# EAGLE design 5VPart (EAGLE 9.6.2)
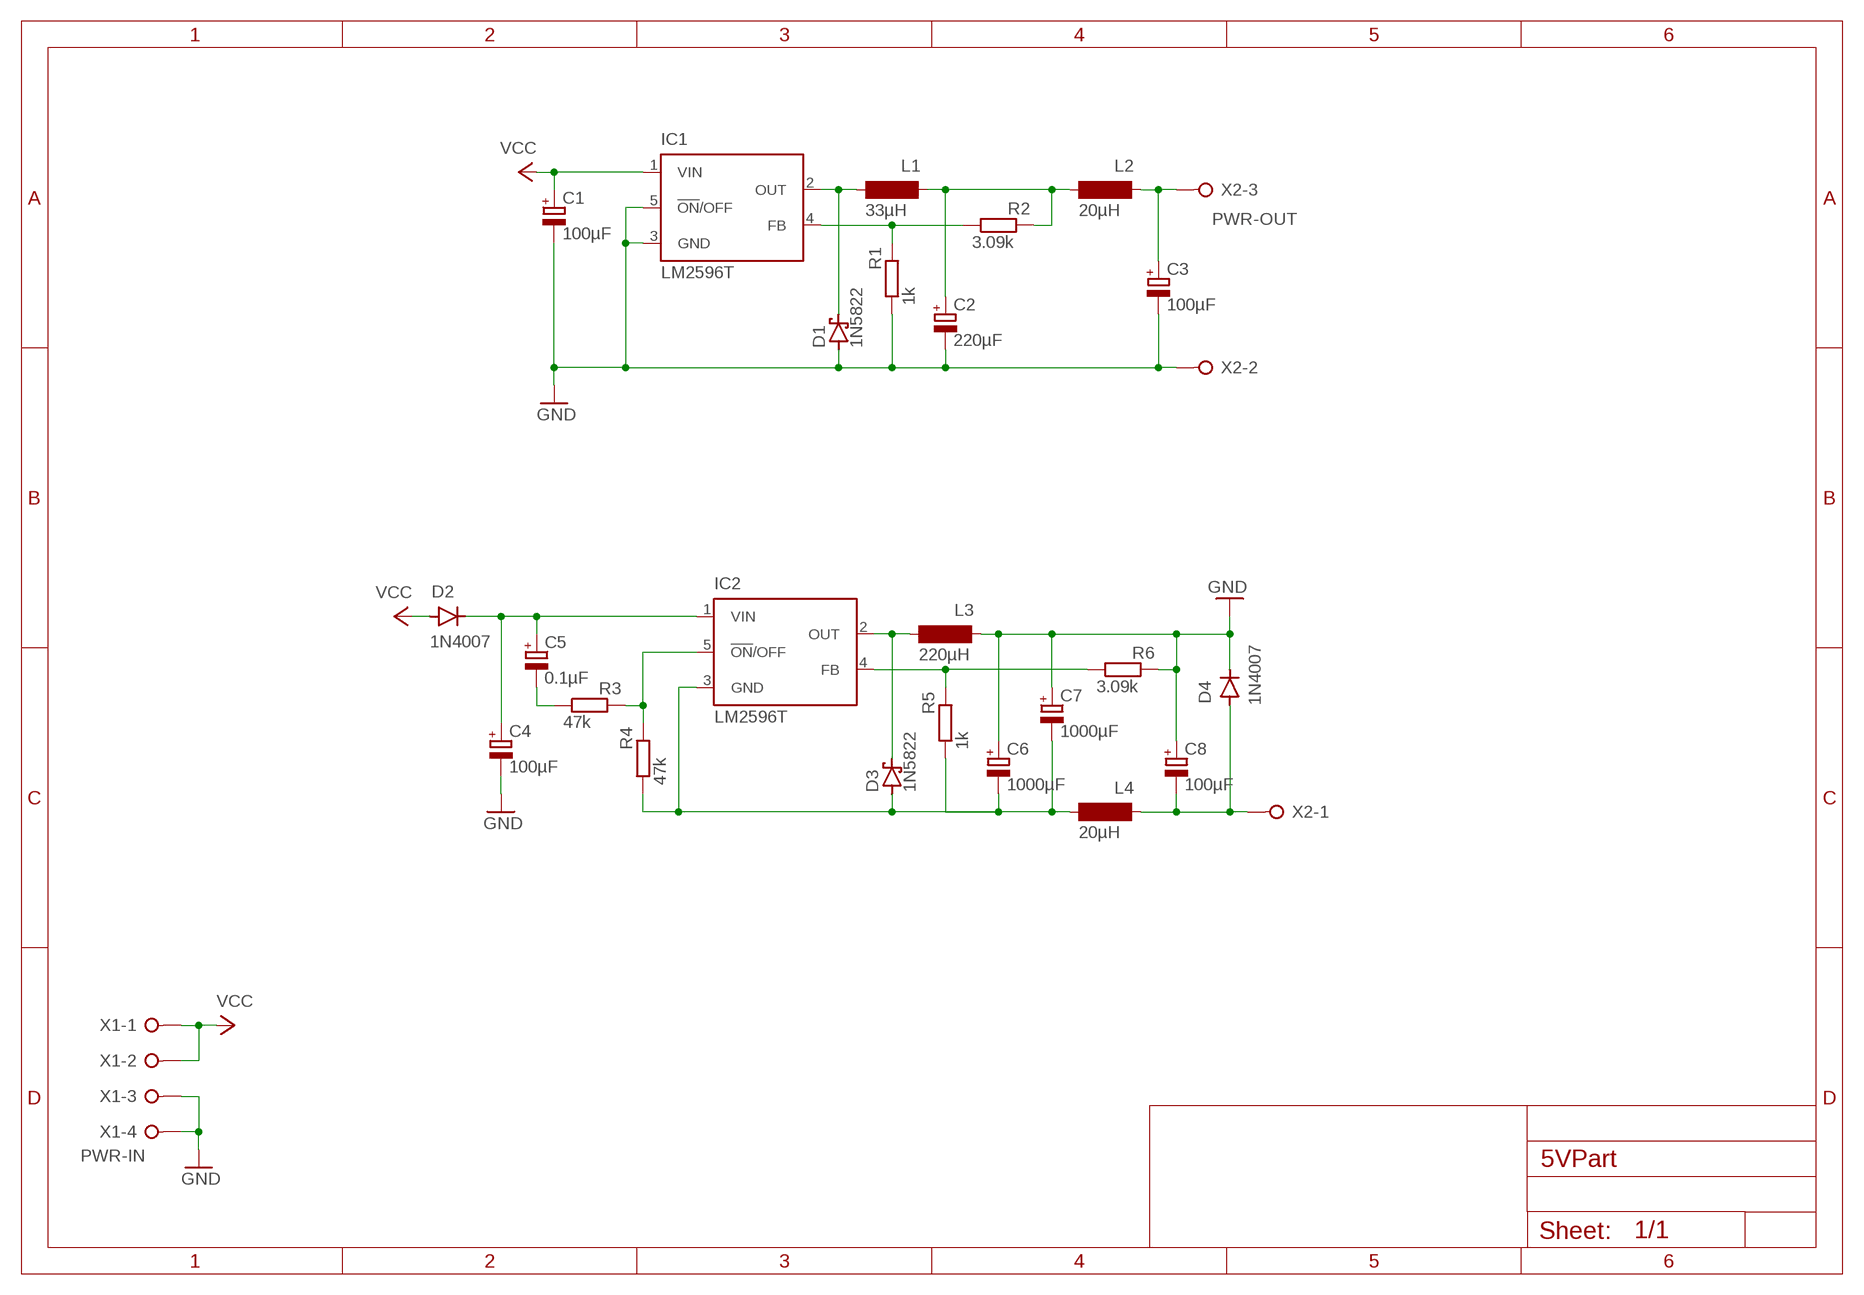
[diagram p0: schematic, sheet 1]

## Parts
C1  100µF  CPOL-EUE2.5-6  [E2,5-6]
C2  220µF  CPOL-EUE2.5-6  [E2,5-6]
C3  100µF  CPOL-EUE2.5-6  [E2,5-6]
C4  100µF  CPOL-EUE2.5-6  [E2,5-6]
C5  0.1µF  CPOL-EUE2-4  [E2-4]
C6  1000µF  CPOL-EUE5-10.5  [E5-10,5]
C7  1000µF  CPOL-EUE5-10.5  [E5-10,5]
C8  100µF  CPOL-EUE2.5-6  [E2,5-6]
D1  1N5822  1N5908  [C4111-15]
D2  1N4007  [DO-41]
D3  1N5822  1N5908  [C4111-15]
D4  1N4007  [DO-41]
IC1  LM2596T  [T05D]
IC2  LM2596T  [T05D]
L1  33µH  IND-120-330K  [IND-120]
L2  20µH  B82111B0000C020  [B82111B]
L3  220µH  11PHC-221K-50  [11PHC]
L4  20µH  B82111B0000C020  [B82111B]
R1  1k  R-EU_0207/10  [0207/10]
R2  3.09k  R-EU_0207/10  [0207/10]
R3  47k  R-EU_0207/10  [0207/10]
R4  47k  R-EU_0207/10  [0207/10]
R5  1k  R-EU_0207/10  [0207/10]
R6  3.09k  R-EU_0207/10  [0207/10]
X1  PWR-IN  W237-04P  [W237-4P]
X2  PWR-OUT  W237-03P  [W237-133]

## Nets
GND: C1.- C2.- C3.- C4.- C6.+ C7.+ C8.+ D1.A D4.C IC1.3(GND) IC1.5(!ON!/OFF) L3.P$2 R1.1 R6.2 X1.3 X1.4 X2.2
N$1: C4.+ C5.+ D2.C IC2.1(VIN)
N$3: C8.- D4.A L4.P$2 X2.1
N$4: D1.C IC1.2(OUT) L1.P$1
N$5: IC1.4(FB) R1.2 R2.1
N$6: C2.+ L1.P$2 L2.P$1 R2.2
N$7: C3.+ L2.P$2 X2.3
N$9: C5.- R3.1
N$10: IC2.5(!ON!/OFF) R3.2 R4.2
N$11: C6.- C7.- D3.A IC2.3(GND) L4.P$1 R4.1 R5.1
N$12: D3.C IC2.2(OUT) L3.P$1
N$14: IC2.4(FB) R5.2 R6.1
VCC: C1.+ D2.A IC1.1(VIN) X1.1 X1.2

## Library data of the parts
C1-C8 = rcl:CPOL-EU: POLARIZED CAPACITOR, European symbol; SPICEPREFIX: C
D1 D3 = diode:1N5908: DIODE schottky
D2 D4 = Diodes:1N4007: DIODE GEN PURP 1KV 1A DO41 Manufacturer's datasheet <https://www.mccsemi.com/pdf/Products/1N4001-1N4007(DO-41).pdf>; CREATED_BY: PCBLayout.com; DIGIKEY_PART_NUMBER: 1N4007MSCT-ND; MANUFACTURER: Micro Commercial Co; MPN: 1N4007; PACKAGE: DO-41
IC1 IC2 = national-semiconductor:LM2596: SIMPLE SWITCHER® Power Converter 150 kHz 3A Step-Down Voltage Regulator Source: http://www.national.com/ds/LM/LM2596.pdf; MPN: LM2596T-ADJ/LF02; OC_FARNELL: 9494162; OC_NEWARK: 65K5910
L1 = bb84:IND-120-330K
L2 L4 = bb84:B82111B0000C020: Axiale VHF-Drossel Epcos B82111B Ferritzylinderkern mit einer Schicht lackiertem Kupferdraht umwickelt, Wicklung als Isolierhülse aus Polyester Mit hoher Resonanzfrequenz. Für HF-Unterdrückung und HF-Filter, Störimpulsunterdrückung in kleinen Geräten, Entkopplung bei Telekomgeräten und in der Unterhaltungselektronik VDE 0565-2 (nicht B82500). Eigenschaft Wert Induktivität 20 μH Gleichstrom max. 3A Montageart Axial Gleichstromwiderstand max. 54mΩ Toleranz ±20% Durchmesser 6mm Länge 29mm Abmessungen 6 (Dia.) x 29mm Kernmaterial Ferrit Resonanzfrequenz max. 125MHz Serie B82111B Betriebstemperatur min. -55°C Anschlussdurchmesser 0.5mm Betriebstemperatur max. +125°C Anschlussklemmentyp Axialanschluss
L3 = bb84:11PHC-221K-50: Stehende-Induktivität, 11PHC, Ferrit, 220 µH Allgemeines Typ: Induktivität Bauform: 11PHC Toleranz: ±10% Anschlüsse / Schnittstellen Anschluss: radial, stehend Elektrische Werte Induktivität: 220 µH Strom: 1,68A Widerstand: 0,53 Ohm Maße Ø: 12,0mm Höhe: 15,0mm Rastermaß: 5,0 mm Herstellerangaben Hersteller: FASTRON Artikelnummer des Herstellers: 11PHC-221K-50 Verpackungsgewicht: 0.004kg RoHS: konform EAN/GTIN: 9900001386770
R1-R6 = rcl:R-EU_: RESISTOR, European symbol; SPICEPREFIX: R
X1 = con-wago-508:W237-04P: WAGO SREW CLAMP; OC_FARNELL: unknown; OC_NEWARK: unknown
X2 = con-wago-508:W237-03P: WAGO SREW CLAMP; OC_FARNELL: unknown; OC_NEWARK: unknown

## Board
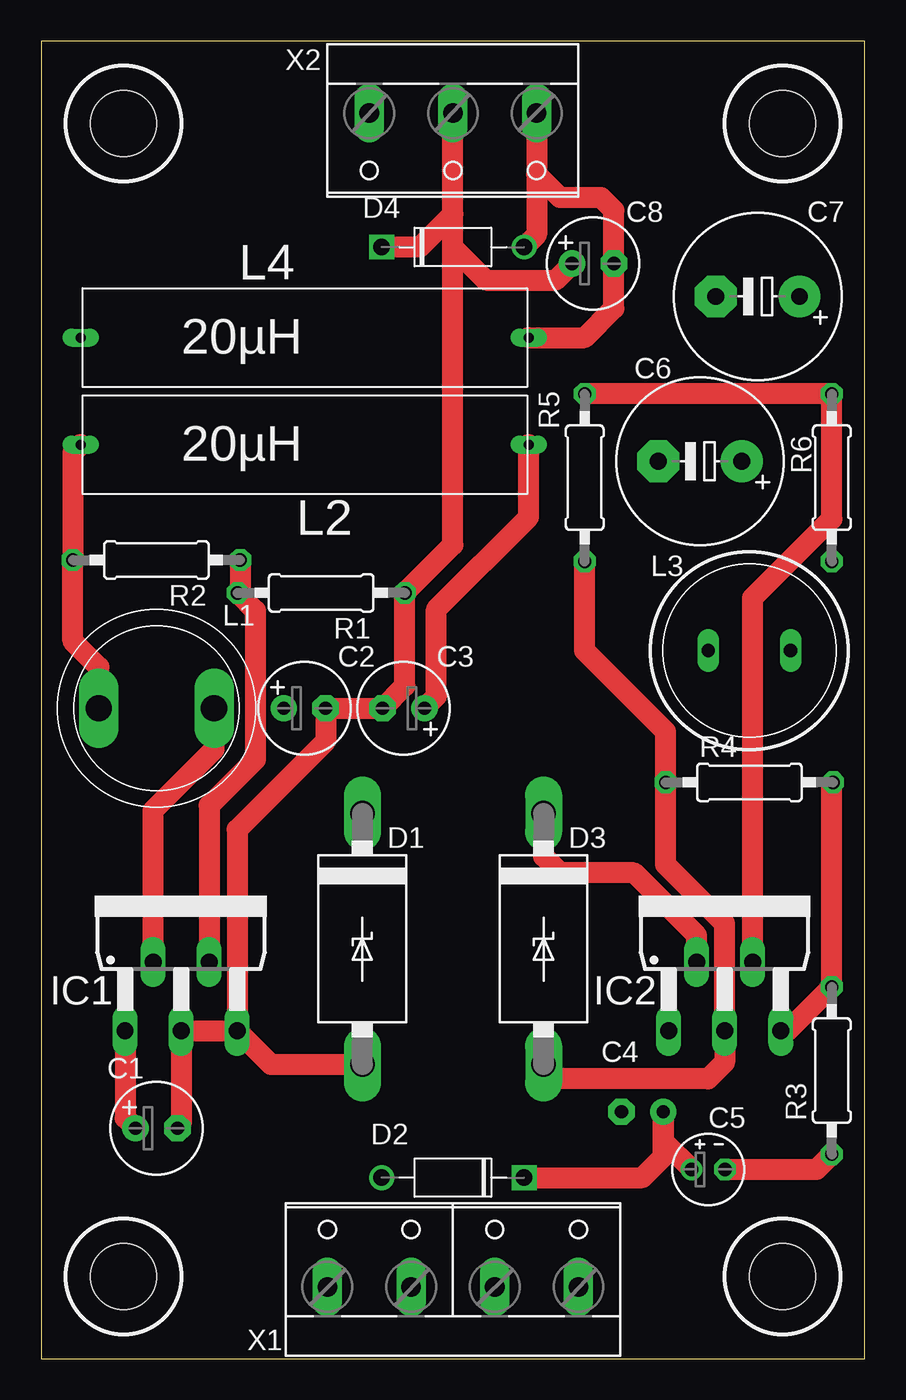
[diagram p1: board, top side]
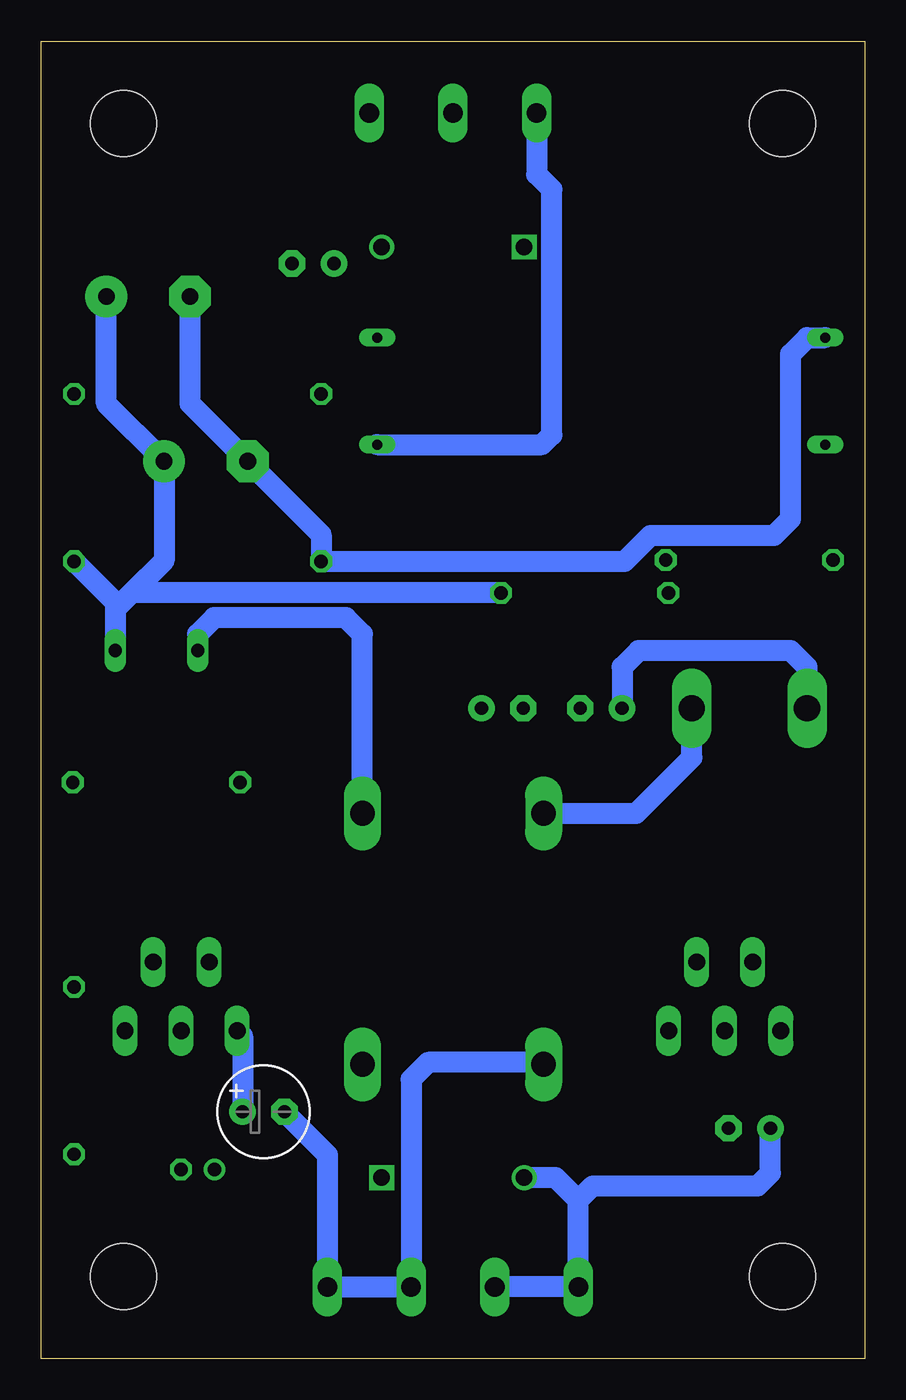
[diagram p2: board, bottom side, seen from below]

Size 50 x 80 mm. Coordinates in mm from the lower left corner, seen from the top.
Outline: 0,0 50,0 50,80 0,80 0,0
Copper layers (1*16): Top 0.035mm / dielectric 1.5mm / Bottom 0.035mm
Design rules "default *": minimum track width 50mil, minimum drill 0.5mm, track to track 6mil, track to pad 6mil, pad to pad 6mil, via to via 6mil, smd to smd 6mil, copper to edge 40mil, drill to drill 6mil, minimum pad ring 10mil, minimum via ring 8mil, stop-mask expansion 4mil, vias tented up to drill 0mil, thermal gap 10mil
Holes 4 mm at 5,5 5,75 45,5 45,75

### Footprints (pad centres in the part's own frame; a part is rotated, then mirrored left to right if it is on the bottom)
E2,5-6 = drill 0.813 pad 1.6: + -1.27,0 | drill 0.813 pad 1.6 octagon: - 1.27,0
E2-4 = drill 0.813 pad 1.27: + -1.016,0 | drill 0.813 pad 1.27 octagon: - 1.016,0
E5-10,5 = drill 1.016 pad 2.54: + -2.54,0 | drill 1.016 pad 2.54 octagon: - 2.54,0
C4111-15 = drill 1.499 long: A 7.62,0; C -7.62,0
DO-41 = drill 1: A 4.325,0 | drill 1 square: C -4.325,0
T05D = drill 1.016 long: 1 -3.404,-5.08; 2 -1.702,-0.914; 3 0,-5.08; 4 1.702,-0.914; 5 3.404,-5.08
IND-120 = drill 1.6 long: P$1 -3.5,0; P$2 3.5,0
B82111B = drill 0.6 long: P$1 -13.6,0; P$2 13.6,0
11PHC = drill 0.8 long: P$1 -2.5,0; P$2 2.5,0
0207/10 = drill 0.813 octagon: 1 -5.08,0; 2 5.08,0
W237-4P = drill 1.194 long: 1 -7.62,-0.635; 2 -2.54,-0.635; 3 2.54,-0.635; 4 7.62,-0.635
W237-133 = drill 1.194 long: 1 -5.08,-0.635; 2 0,-0.635; 3 5.08,-0.635

### Placement (x,y rotation side)
C1  7,14 0 top
C2  16,39.5 0 top
C3  22,39.5 180 top
C4  36.5,15 0 bottom
C5  40.5,11.5 0 top
C6  40,54.5 180 top
C7  43.5,64.5 180 top
C8  33.5,66.5 0 top
D1  19.5,25.5 270 top
D2  25,11 180 top
D3  30.5,25.5 270 top
D4  25,67.5 0 top
IC1  8.5,25 0 top
IC2  41.5,25 0 top
L1  7,39.5 180 top
L2  16,55.5 0 top
L3  43,43 0 top
L4  16,62 0 top
R1  17,46.5 180 top
R2  7,48.5 180 top
R3  48,17.5 90 top
R4  43,35 0 top
R5  33,53.5 90 top
R6  48,53.5 270 top
X1  25,5 0 top
X2  25,75 180 top

### Tracks (layer width: path | path; a pad name or v marks a point on that pad's centre or on a via)
GND
  Top 1.27: C1.- 8.5,14.23 IC1.3 IC1.5 | IC1.5 13.94,17.88 D1.A | IC1.5 11.9,32.13 17.27,37.5 C2.- C3.- 22.08,40.85 R1.1 25,49.42 25,67.5 | 25,67.5 25,69.5 | 25,69.5 X2.2 | 25,69.5 23,67.5 D4.C | 25,67.5 27,65.5 31.23,65.5 C8.+
  Bottom 1.27: D1.A 19.62,18 26.5,18 27.54,16.96 X1.3 X1.4 32.62,12.39 C4.- | R1.1 44.5,46.5 | 45.5,45.5 L3.P$2 | 45.5,45.5 44.5,46.5 | R6.2 45.5,45.92 45.5,45.5 | 44.5,46.5 42.54,48.46 C6.+ 46.04,58 C7.+
N$1
  Top 1.27: C5.+ 37.77,13.21 C4.+ 37.77,12.27 36.5,11 D2.C
  Bottom 1.27: IC2.1 37.77,19.59 C4.+
N$3
  Top 1.27: L4.P$2 33,62 34.77,63.77 C8.- 34.77,69.73 34,70.5 31.5,70.5 30.08,71.92 | X2.1 30.08,71.92 | 30.08,71.92 30.08,68.25 D4.A
N$4
  Top 1.27: IC1.2 6.8,33.3 10.5,37 L1.P$1
  Bottom 1.27: D1.C 13.88,33.12 10.5,36.5 L1.P$1
N$5
  Top 1.27: R2.1 12.08,46.66 R1.2 13,45.42 13,36.38 10.2,33.59 IC1.4
N$6
  Top 1.27: L2.P$1 1.92,55.02 R2.2 1.92,43.58 3.5,42 L1.P$2
  Bottom 1.27: L1.P$2 3.5,42 4.5,43 13.73,43 14.73,42 C2.+
N$7
  Top 1.27: C3.+ 24,40.23 24,45.5 29.6,51.1 L2.P$2
  Bottom 1.27: L2.P$2 19.6,55.5 19,56.1 19,71 19.92,71.92 X2.3
N$9
  Top 1.27: C5.- 47.08,11.5 R3.1
N$10
  Top 1.27: IC2.5 45.34,19.92 R3.2 48,34.92 R4.2
N$11
  Top 1.27: R5.1 33,43 37.92,38.08 R4.1 37.92,30 41.5,26.42 IC2.3 41.5,18 40.5,17 31.38,17 D3.A
  Bottom 1.27: L4.P$1 3.5,62 4.5,61 4.5,51 5.5,50 13,50 14.58,48.42 R5.1 33,50.04 C6.- 40.96,58 C7.-
N$12
  Top 1.27: IC2.2 39.8,25.7 36,29.5 31.5,29.5 30.5,30.5 D3.C
  Bottom 1.27: D3.C 30.5,44 31.5,45 39.5,45 40.5,44 L3.P$1
N$14
  Top 1.27: R5.2 R6.1 48,51 43.2,46.2 IC2.4
VCC
  Top 1.27: IC1.1 5.1,14.63 C1.+
  Bottom 1.27: 17.38,9.62 X1.1 X1.2 | 17.38,9.62 16.5,10.5 6.5,10.5 5.73,11.27 C1.+ | 17.38,9.62 18.76,11 D2.A